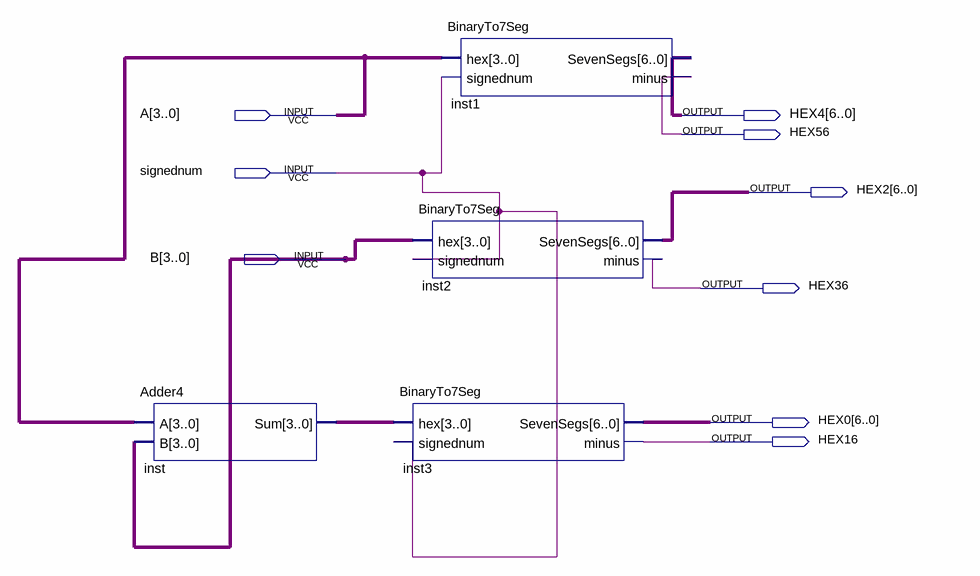
[diagram p0: schematic sheet]
// Quartus schematic Adder7Seg.bdf as structural Verilog: 4 symbols, 9 pins
module Adder7Seg (
  input  [3:0] A,
  input  signednum,
  input  [3:0] B,
  output [6:0] HEX4,
  output HEX56,
  output [6:0] HEX2,
  output HEX36,
  output [6:0] HEX0,
  output HEX16
);

  wire [3:0] inst_sum;

  Adder4 inst (.A(A), .B(B), .Sum(inst_sum));
  BinaryTo7Seg inst1 (.hex(A), .signednum(signednum), .SevenSegs(HEX4), .minus(HEX56));
  BinaryTo7Seg inst2 (.hex(B), .signednum(signednum), .SevenSegs(HEX2), .minus(HEX36));
  BinaryTo7Seg inst3 (.hex(inst_sum), .signednum(signednum), .SevenSegs(HEX0), .minus(HEX16));
endmodule
